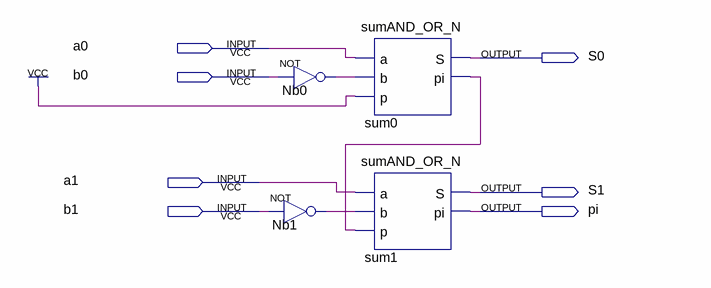
[diagram p0: schematic sheet]
// Quartus schematic sub2.bdf as structural Verilog: 4 symbols, 7 pins
module sub2 (
  input  a0,
  input  b0,
  input  a1,
  input  b1,
  output S0,
  output S1,
  output pi
);

  wire Nb0_out, Nb1_out, sum0_pi;

  not Nb0 (Nb0_out, b0);
  not Nb1 (Nb1_out, b1);
  sumAND_OR_N sum0 (.a(a0), .b(Nb0_out), .p(1'b1), .S(S0), .pi(sum0_pi));
  sumAND_OR_N sum1 (.a(a1), .b(Nb1_out), .p(sum0_pi), .S(S1), .pi(pi));
endmodule
